# Altium schematic sheet as14120_x31_adc.SchDoc
size A3; PageSetup: Record=PageOptions|CenterHorizontal=True|CenterVertical=True|PrintScale=1.05|XCorrection=1.00|YCorrection=1.00|PrintKind=0|BorderSize=5000000|LeftOffset=0|BottomOffset=0|Orientation=2|PaperLength=4290|PaperWidth=3060|Scale=100|PaperSource=7|PrintQuality=-4|MediaType=1|DitherType=10|PaperKind=A3 (без полей / бумага продольной резки) (297 x 420 мм)|PrintScaleMode=1
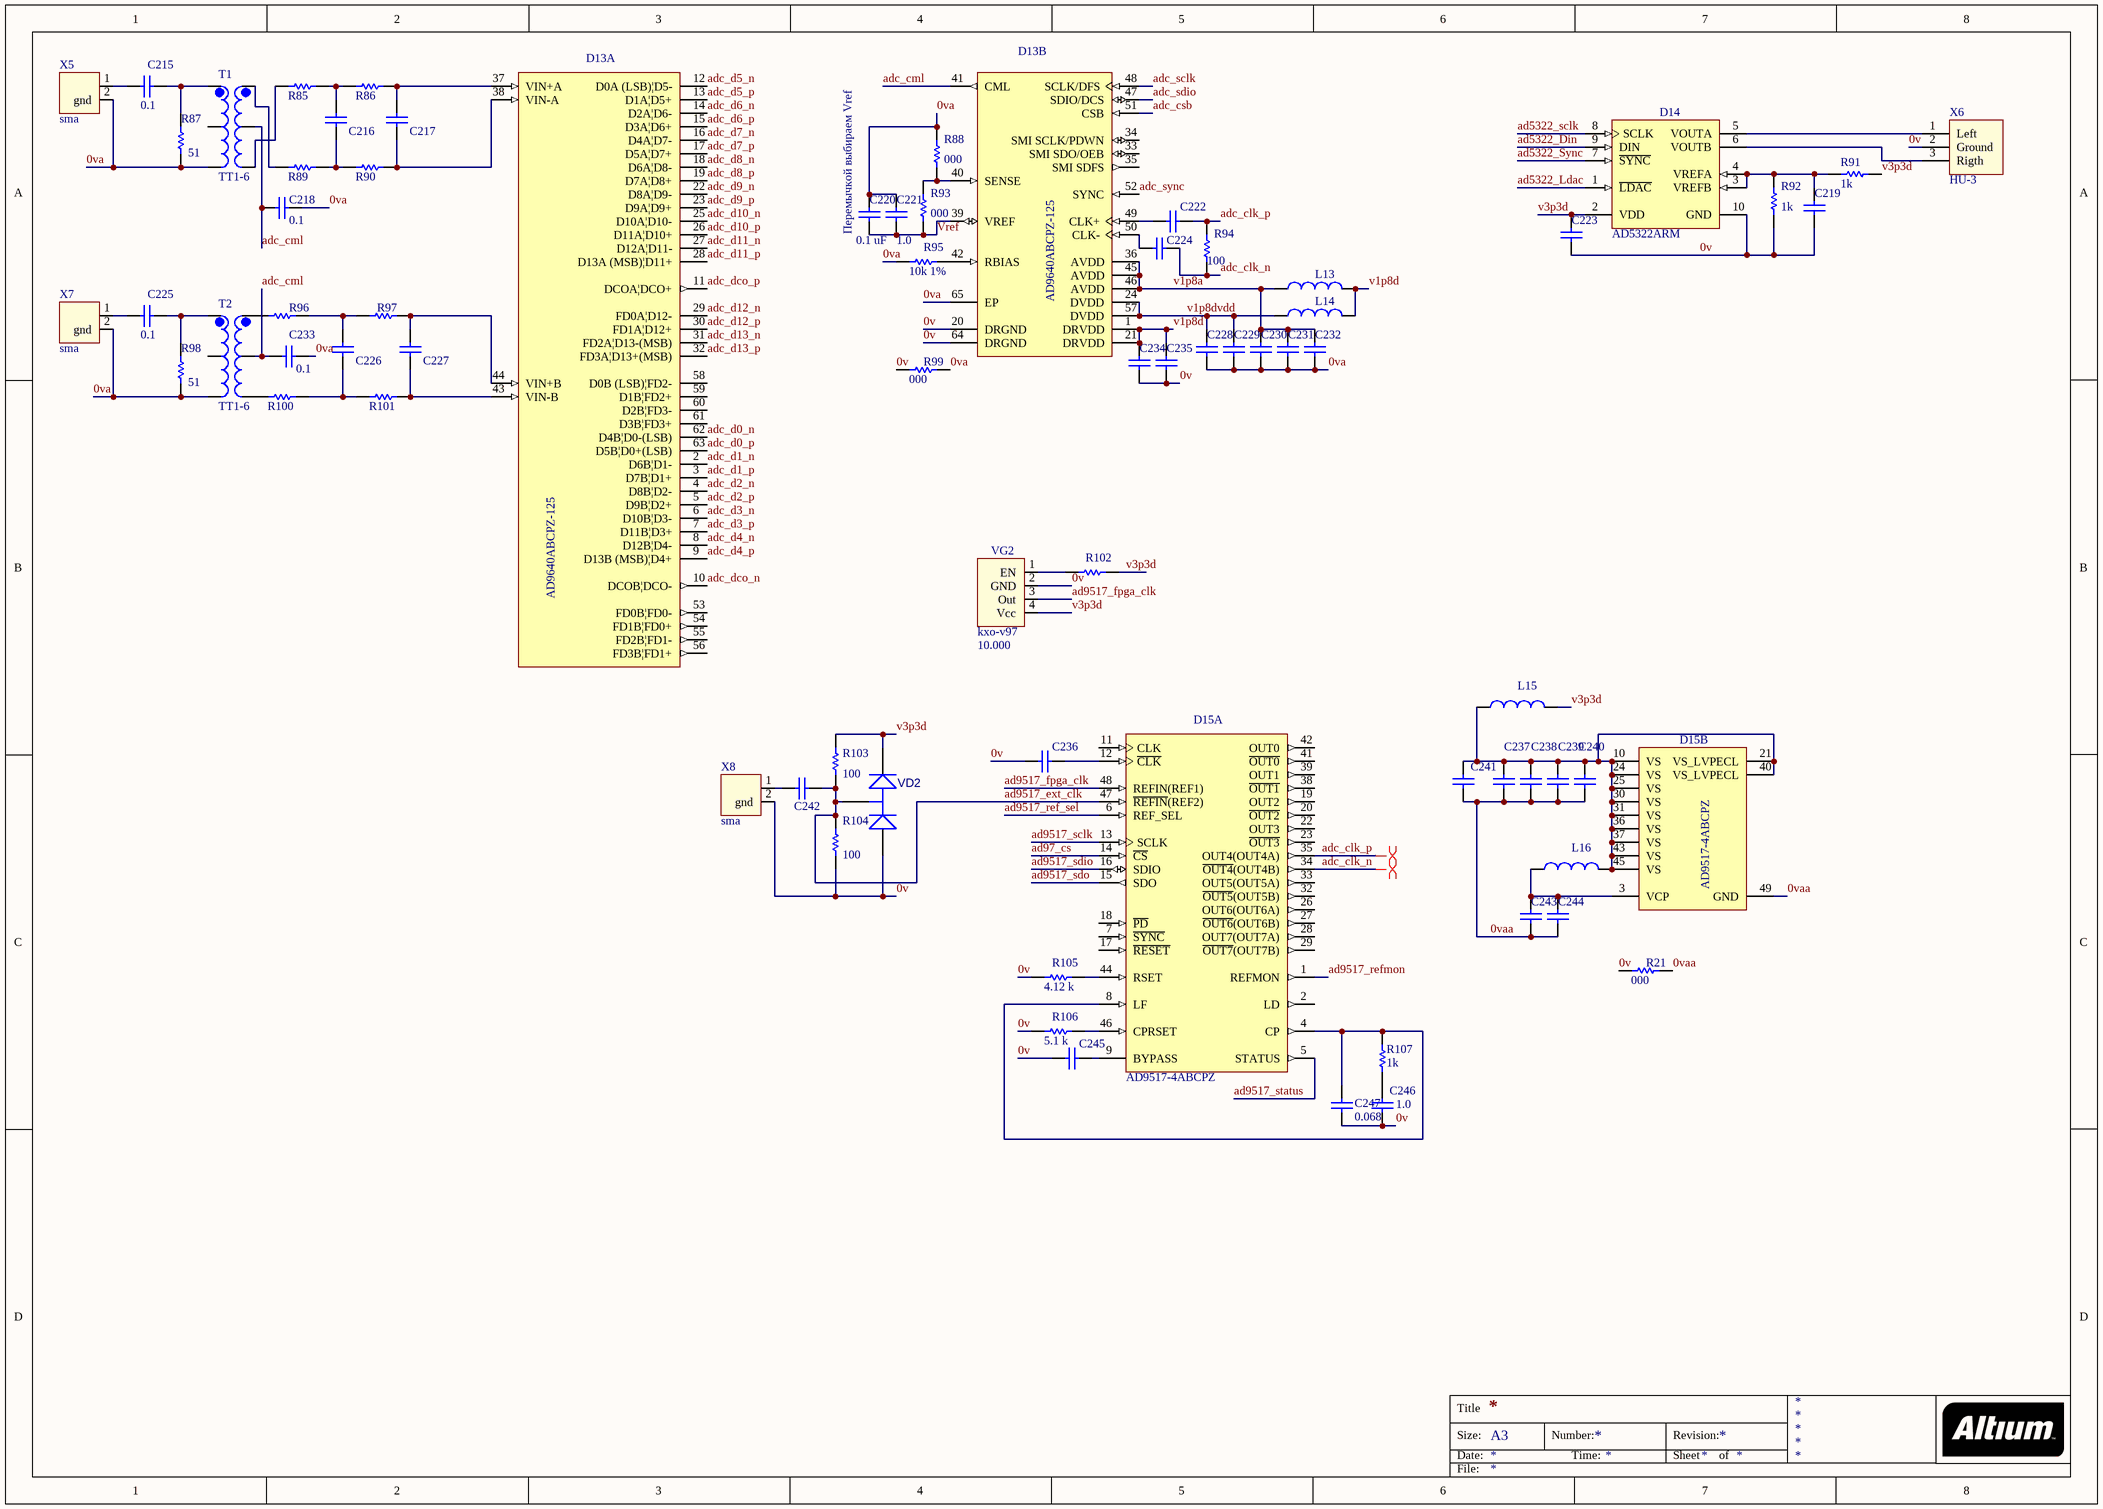
[diagram p0: as14120_x31_adc.SchDoc]

## Parts
C215  value 0.1  [CAPC0402(1005)60_M]  (hidden comment: CAP 1uF 10V 0402(1005))
C216  CAP 1uF 10V 0402(1005)  [CAPC0402(1005)60_M]  (value not drawn)
C217  CAP 1uF 10V 0402(1005)  [CAPC0402(1005)60_M]  (value not drawn)
C218  value 0.1  [CAPC0402(1005)60_M]  (hidden comment: CAP 1uF 10V 0402(1005))
C219  CAP 1uF 10V 0402(1005)  [CAPC0402(1005)60_M]  (value not drawn)
C220  value 0.1 uF  [CAPC0402(1005)60_M]  (hidden comment: CAP 1uF 10V 0402(1005))
C221  value 1.0  [CAPC0402(1005)60_M]  (hidden comment: CAP 1uF 10V 0402(1005))
C222  CAP 1uF 10V 0402(1005)  [CAPC0402(1005)60_M]  (value not drawn)
C223  CAP 1uF 10V 0402(1005)  [CAPC0402(1005)60_M]  (value not drawn)
C224  CAP 1uF 10V 0402(1005)  [CAPC0402(1005)60_M]  (value not drawn)
C225  value 0.1  [CAPC0402(1005)60_M]  (hidden comment: CAP 1uF 10V 0402(1005))
C226  CAP 1uF 10V 0402(1005)  [CAPC0402(1005)60_M]  (value not drawn)
C227  CAP 1uF 10V 0402(1005)  [CAPC0402(1005)60_M]  (value not drawn)
C228  CAP 1uF 10V 0402(1005)  [CAPC0402(1005)60_M]  (value not drawn)
C229  CAP 1uF 10V 0402(1005)  [CAPC0402(1005)60_M]  (value not drawn)
C230  CAP 1uF 10V 0402(1005)  [CAPC0402(1005)60_M]  (value not drawn)
C231  CAP 1uF 10V 0402(1005)  [CAPC0402(1005)60_M]  (value not drawn)
C232  CAP 1uF 10V 0402(1005)  [CAPC0402(1005)60_M]  (value not drawn)
C233  value 0.1  [CAPC0402(1005)60_M]  (hidden comment: CAP 1uF 10V 0402(1005))
C234  CAP 1uF 10V 0402(1005)  [CAPC0402(1005)60_M]  (value not drawn)
C235  CAP 1uF 10V 0402(1005)  [CAPC0402(1005)60_M]  (value not drawn)
C236  CAP 1uF 10V 0402(1005)  [CAPC0402(1005)60_M]  (value not drawn)
C237  CAP 1uF 10V 0402(1005)  [CAPC0402(1005)60_M]  (value not drawn)
C238  CAP 1uF 10V 0402(1005)  [CAPC0402(1005)60_M]  (value not drawn)
C239  CAP 1uF 10V 0402(1005)  [CAPC0402(1005)60_M]  (value not drawn)
C240  CAP 1uF 10V 0402(1005)  [CAPC0402(1005)60_M]  (value not drawn)
C241  CAP 1uF 10V 0402(1005)  [CAPC0402(1005)60_M]  (value not drawn)
C242  CAP 1uF 10V 0402(1005)  [CAPC0402(1005)60_M]  (value not drawn)
C243  CAP 1uF 10V 0402(1005)  [CAPC0402(1005)60_M]  (value not drawn)
C244  CAP 1uF 10V 0402(1005)  [CAPC0402(1005)60_M]  (value not drawn)
C245  CAP 1uF 10V 0402(1005)  [CAPC0402(1005)60_M]  (value not drawn)
C246  value 1.0  [CAPC0805(2012)100_N]  (hidden comment: CAP_0805)
C247  value 0.068  [CAPC0805(2012)100_N]  (hidden comment: CAP_0805)
D13  AD9640ABCPZ-125  [CP-64-6_N]  (parts A,B of 2)
D14  AD5322ARM  [RM-10_L]
D15  AD9517-4ABCPZ  [ADI-CP-48-8_L]  (parts A,B of 2)
L13  BLM21PG300SN1D  [CAPC0805(2012)100_N]  (value not drawn)
L14  BLM21PG300SN1D  [CAPC0805(2012)100_N]  (value not drawn)
L15  BLM21PG300SN1D  [CAPC0805(2012)100_N]  (value not drawn)
L16  BLM21PG300SN1D  [CAPC0805(2012)100_N]  (value not drawn)
R21  000  [RESC0603(1608)_L]
R85  1K 5% 0603(1608)  [RESC0603(1608)_L]  (value not drawn)
R86  1K 5% 0603(1608)  [RESC0603(1608)_L]  (value not drawn)
R87  value 51  [RESC0805(2012)_L]  (hidden comment: 1K 1% 0805(2012))
R88  value 000  [RESC0603(1608)_L]  (hidden comment: 1K 5% 0603(1608))
R89  1K 5% 0603(1608)  [RESC0603(1608)_L]  (value not drawn)
R90  1K 5% 0603(1608)  [RESC0603(1608)_L]  (value not drawn)
R91  1k  [RESC0603(1608)_L]
R92  1k  [RESC0603(1608)_L]
R93  value 000  [RESC0603(1608)_L]  (hidden comment: 1K 5% 0603(1608))
R94  100  [RESC0805(2012)_L]
R95  10k 1%  [RESC0805(2012)_L]
R96  1K 5% 0603(1608)  [RESC0603(1608)_L]  (value not drawn)
R97  1K 5% 0603(1608)  [RESC0603(1608)_L]  (value not drawn)
R98  value 51  [RESC0805(2012)_L]  (hidden comment: 1K 1% 0805(2012))
R99  000  [RESC0603(1608)_L]
R100  1K 5% 0603(1608)  [RESC0603(1608)_L]  (value not drawn)
R101  1K 5% 0603(1608)  [RESC0603(1608)_L]  (value not drawn)
R102  1K 5% 0603(1608)  [RESC0603(1608)_L]  (value not drawn)
R103  value 100  [RESC0805(2012)_L]  (hidden comment: 1K 1% 0805(2012))
R104  value 100  [RESC0805(2012)_L]  (hidden comment: 1K 1% 0805(2012))
R105  value 4.12 k  [RESC0805(2012)_L]  (hidden comment: 1K 1% 0805(2012))
R106  value 5.1 k  [RESC0805(2012)_L]  (hidden comment: 1K 1% 0805(2012))
R107  value 1k  [RESC0805(2012)_L]  (hidden comment: 1K 1% 0805(2012))
T1  TT1-6  [TT!-6-KK81]
T2  TT1-6  [TT!-6-KK81]
VD2  BAV99  [SO-G3/X.9]  (value not drawn)
VG2  kxo-v97  value 10.000  [kxo-v97]
X5  sma  [sma]
X6  HU-3  [HU-3]
X7  sma  [sma]
X8  sma  [sma]

## Nets
0v: C219.1 C223.1 C234.1 C235.1 C236.1 C245.1 C246.1 C247.1 D13.20(DRGND) D13.64(DRGND) D14.10(GND) R21.1 R92.2 R99.1 R104.1 R105.2 R106.2 VD2.3(A) VG2.2(GND) X6.2(Ground) X8.2(gnd)
0va: C218.2 C220.2 C221.2 C228.1 C229.1 C230.1 C231.1 C232.1 C233.2 D13.65(EP) R87.1 R88.1 R95.2 R98.1 R99.2 T1.6 T2.6 X5.2(gnd) X7.2(gnd)
0vaa: C237.1 C238.1 C239.1 C240.1 C241.1 C243.1 C244.1 D15.49(GND) R21.2
ad97_cs: D15.14(~{CS})
ad5322_Din: D14.9(DIN)
ad5322_Ldac: D14.1(~{LDAC})
ad5322_sclk: D14.8(SCLK)
ad5322_Sync: D14.7(~{SYNC})
ad9517_ext_clk: C242.2 D15.47(~{REFIN}(REF2)) R103.1 R104.2 VD2.1(C)
ad9517_fpga_clk: D15.48(REFIN(REF1)) VG2.3(Out)
ad9517_ref_sel: D15.6(REF_SEL)
ad9517_refmon: D15.1(REFMON)
ad9517_sclk: D15.13(SCLK)
ad9517_sdio: D15.16(SDIO)
ad9517_sdo: D15.15(SDO)
ad9517_status: D15.5(STATUS)
adc_clk_n: C224.1 D15.34(~{OUT4}(OUT4B)) R94.1
adc_clk_p: C222.1 D15.35(OUT4(OUT4A)) R94.2
adc_cml: C218.1 C233.1 D13.41(CML) T1.2 T2.2
adc_csb: D13.51(CSB)
adc_d0_n: D13.62(D4B|D0-(LSB))
adc_d0_p: D13.63(D5B|D0+(LSB))
adc_d1_n: D13.2(D6B|D1-)
adc_d1_p: D13.3(D7B|D1+)
adc_d2_n: D13.4(D8B|D2-)
adc_d2_p: D13.5(D9B|D2+)
adc_d3_n: D13.6(D10B|D3-)
adc_d3_p: D13.7(D11B|D3+)
adc_d4_n: D13.8(D12B|D4-)
adc_d4_p: D13.9(D13B_(MSB)|D4+)
adc_d5_n: D13.12(D0A_(LSB)|D5-)
adc_d5_p: D13.13(D1A|D5+)
adc_d6_n: D13.14(D2A|D6-)
adc_d6_p: D13.15(D3A|D6+)
adc_d7_n: D13.16(D4A|D7-)
adc_d7_p: D13.17(D5A|D7+)
adc_d8_n: D13.18(D6A|D8-)
adc_d8_p: D13.19(D7A|D8+)
adc_d9_n: D13.22(D8A|D9-)
adc_d9_p: D13.23(D9A|D9+)
adc_d10_n: D13.25(D10A|D10-)
adc_d10_p: D13.26(D11A|D10+)
adc_d11_n: D13.27(D12A|D11-)
adc_d11_p: D13.28(D13A_(MSB)|D11+)
adc_d12_n: D13.29(FD0A|D12-)
adc_d12_p: D13.30(FD1A|D12+)
adc_d13_n: D13.31(FD2A|D13-(MSB))
adc_d13_p: D13.32(FD3A|D13+(MSB))
adc_dco_n: D13.10(DCOB|DCO-)
adc_dco_p: D13.11(DCOA|DCO+)
adc_sclk: D13.48(SCLK/DFS)
adc_sdio: D13.47(SDIO/DCS)
adc_sync: D13.52(SYNC)
v1p8a: C230.2 C231.2 C232.2 D13.36(AVDD) D13.45(AVDD) D13.46(AVDD) L13.1
v1p8d: C234.2 C235.2 D13.1(DRVDD) D13.21(DRVDD) L13.2 L14.2
v1p8dvdd: C228.2 C229.2 D13.24(DVDD) D13.57(DVDD) L14.1
v3p3d: C223.2 D14.2(VDD) L15.2 R91.2 R102.1 R103.2 VD2.2(K) VG2.4(Vcc)
Vref: C220.1 C221.1 D13.39(VREF) R93.2
NetC215_1: C215.1 X5.1
NetC215_2: C215.2 R87.2 T1.4
NetC216_1: C216.1 R89.1 R90.2
NetC216_2: C216.2 R85.1 R86.2
NetC217_1: C217.1 D13.38(VIN-A) R90.1
NetC217_2: C217.2 D13.37(VIN+A) R86.1
NetC219_2: C219.2 D14.3(VREFB) D14.4(VREFA) R91.1 R92.1
NetC222_2: C222.2 D13.49(CLK+)
NetC224_2: C224.2 D13.50(CLK-)
NetC225_1: C225.1 X7.1
NetC225_2: C225.2 R98.2 T2.4
NetC226_1: C226.1 R100.1 R101.2
NetC226_2: C226.2 R96.1 R97.2
NetC227_1: C227.1 D13.43(VIN-B) R101.1
NetC227_2: C227.2 D13.44(VIN+B) R97.1
NetC236_2: C236.2 D15.12(~{CLK})
NetC237_2: C237.2 C238.2 C239.2 C240.2 C241.2 D15.10(VS) D15.21(VS_LVPECL) D15.24(VS) D15.25(VS) D15.30(VS) D15.31(VS) D15.36(VS) D15.37(VS) D15.40(VS_LVPECL) D15.43(VS) D15.45(VS) L15.1 L16.2
NetC242_1: C242.1 X8.1
NetC243_2: C243.2 C244.2 D15.3(VCP) L16.1
NetC245_2: C245.2 D15.9(BYPASS)
NetC246_2: C246.2 R107.2
NetC247_2: C247.2 D15.4(CP) D15.8(LF) R107.1
NetD13_40: D13.40(SENSE) R88.2 R93.1
NetD13_42: D13.42(RBIAS) R95.1
NetD14_5: D14.5(VOUTA) X6.1(Left)
NetD14_6: D14.6(VOUTB) X6.3(Rigth)
NetD15_44: D15.44(RSET) R105.1
NetD15_46: D15.46(CPRSET) R106.1
NetR85_2: R85.2 T1.1
NetR89_2: R89.2 T1.3
NetR96_2: R96.2 T2.3
NetR100_2: R100.2 T2.1
NetR102_2: R102.2 VG2.1(EN)

Not connected (* = marked no-connect by the designer): D13 33(SMI_SDO/OEB) 34(SMI_SCLK/PDWN) 35(SMI_SDFS) 53(FD0B|FD0-) 54(FD1B|FD0+) 55(FD2B|FD1-) 56(FD3B|FD1+) 58(D0B_(LSB)|FD2-) 59(D1B|FD2+) 60(D2B|FD3-) 61(D3B|FD3+); D15 2(LD) 7(~{SYNC}) 11(CLK) 17(~{RESET}) 18(~{PD}) 19(OUT2) 20(~{OUT2}) 22(OUT3) 23(~{OUT3}) 26(OUT6(OUT6A)) 27(~{OUT6}(OUT6B)) 28(OUT7(OUT7A)) 29(~{OUT7}(OUT7B)) 32(~{OUT5}(OUT5B)) 33(OUT5(OUT5A)) 38(~{OUT1}) 39(OUT1) 41(~{OUT0}) 42(OUT0); T1 5; T2 5

## Layout directives
differential pair: adc_clk_n, adc_clk_p

## Notes on the sheet
- (near C220) Перемычкой выбираем Vref
- Title
- Size:
- Date:
- A3
- Number:
- Time:
- Revision:
- Sheet
- of
- File:

## Library data of the parts
C215-C218 C220 C221 C225-C227 C233 = CAP_0402: CAP 1uF 10V ±20% 0402 (1005 Metric) Thickness 0.6mm SMD; Case-Metric: 1005; Case-EIA: 0402; Tolerance: ±20%; Max Thickness: 0.6 mm; Rated Voltage: 10 V; Technology: SMT
  C216 C217 C226 C227: Value: 1uF
C219 C222-C224 C228-C232 C234-C241 C243-C245 = CAP_0402: CAP 1uF 10V ±20% 0402 (1005 Metric) Thickness 0.6mm SMD; Case-Metric: 1005; Case-EIA: 0402; Value: 0.1 uF; Tolerance: ±20%; Max Thickness: 0.6 mm; Rated Voltage: 10 V; Technology: SMT
C242 = CAP_0402: CAP 1uF 10V ±20% 0402 (1005 Metric) Thickness 0.6mm SMD; Case-Metric: 1005; Case-EIA: 0402; Value: 0.01 uF; Tolerance: ±20%; Max Thickness: 0.6 mm; Rated Voltage: 10 V; Technology: SMT
D13 = AD9640ABCPZ-125: Dual 14-Bit Analog-to-Digital Converter with Parallel Interface, 1.8 V, 125MSPS, -40 to +85 degC, CP-64-6, Pb-Free, Tray; Part Number: AD9640-125; Manufacturer: Analog Devices; Resolution (Bits): 14; Channels: 2; Throughput Rate (SPS): 125M; Interface: Par; DatasheetVersion: Rev.B; PackageVersion: 041509-A; PackageReference: CP-64-6; PackageDescription: 64-Lead Lead Frame Chip Scale Package [LFCSP_VQ] 9 x 9 mm Body, Very Thin Quad; RoHS: Y; Packing: Tray; Mounting Technology: Surface Mount; Code_JEDEC: MO-220-VMMD-4; ComponentLink1Description: Manufacturer URL; ComponentLink1URL: http://www.analog.com/en/index.html; ComponentLink2Description: Datasheet; ComponentLink2URL: http://www.analog.com/static/imported-files/data_sheets/AD9640.pdf; ComponentLink3Description: Package Specification; ComponentLink3URL: http://www.analog.com/static/imported-files/packages/PKG_PDF/LFCSP(CP)/CP_64_6.pdf; ComponentLink4Description: Product URL; ComponentLink4URL: http://www.analog.com/en/analog-to-digital-converters/ad-converters/ad9640/products/product.html
D14 = AD5322ARM: Dual 12-Bit Rail-to-Rail Output Digital-to-Analog Converter, 2.5 to 5.5 V, -40 to +105 degC, RM-10, Tube; ADI Part Number: AD5322; Manufacturer: Analog Devices; # DAC Outputs: 2; Max V+: 5.5V; Op Pwr Diss: 2.5mW; Resolution (Bits): 12; Settling Time: 8µs; Single Supply: Yes; DatasheetVersion: Rev.D; PackageVersion: May-2005; PackageReference: RM-10; PackageDescription: 10-Lead Mini Small Outline Package [MSOP]; Packing: Tube; RoHS: N; Mounting Technology: Surface Mount; ComponentLink1Description: Manufacturer URL; ComponentLink1URL: http://www.analog.com/en/index.html; ComponentLink2Description: Datasheet; ComponentLink2URL: http://www.analog.com/static/imported-files/data_sheets/AD5302_5312_5322.pdf; ComponentLink3Description: Package Specification; ComponentLink3URL: http://www.analog.com/static/imported-files/packages/PKG_PDF/MSOP%28RM%29/RM_10.pdf; ComponentLink4Description: URL Link1; ComponentLink4URL: Product URL:http://www.analog.com/en/digital-to-analog-converters/da-converters/ad5322/products/product.html
D15 = AD9517-4ABCPZ: 12-Output Clock Generator with Integrated 2.5 GHz VCO, 1800 MHz Max f-out, CP-48-8, Pb-Free, 260 Tray; Product Description: Multi-Output Clock Generator; +Supply Voltage (V): 3.3; Inputs: 2; Outputs: 12; Dividers: 4; On-Chip VCO or DCO: Yes; Max f-out (MHz): 1800; Output Logic: CMOS; LVDS; LVPECL; DatasheetVersion: Rev.D; PackageVersion: 02-23-2010-C; PackageReference: CP-48-8; PackageDescription: 48-Lead Lead Frame Chip Scale Package [LFCSP_VQ]; Code_JEDEC: MO-220-VKKD-2; ComponentLink1Description: Manufacturer URL; ComponentLink1URL: www.analog.com; ComponentLink2Description: Datasheet; ComponentLink2URL: http://www.analog.com/static/imported-files/data_sheets/AD9517-4.pdf; ComponentLink3Description: Package Specification; ComponentLink3URL: http://www.analog.com/static/imported-files/packages/PKG_PDF/LFCSP(CP)/CP_48_8.pdf
L13-L16 = Ferrite_beat
R21 R88 R91-R93 R99 = RES_0603: 1K 0.1W 5% 0603 (1608 Metric)  SMD; Case-Metric: 1608; Case-EIA: 0603; Tolerance: 5 %; Power: 0.1 W; Technology: SMT
  R21 R99: Value: 000
  R91 R92: Value: 1k
R85 R86 R89 R90 R96 R97 R100 R101 = RES_0603: 1K 0.1W 5% 0603 (1608 Metric)  SMD; Case-Metric: 1608; Value: 1000.00 Ohm; Case-EIA: 0603; Tolerance: 5 %; Power: 0.1 W; Technology: SMT
R87 R94 R95 R98 R103-R107 = RES_0805: 1K 0.125W 1% 0805 (2012 Metric)  SMD; Case-Metric: 2012; Case-EIA: 0805; Tolerance: 1 %; Power: 0.125 W; Technology: SMT
  R94: Value: 100
  R95: Value: 10k 1%
R102 = RES_0603: 1K 0.1W 5% 0603 (1608 Metric)  SMD; Case-EIA: 0603; Case-Metric: 1608; Value: 1000.00 Ohm; Technology: SMT; Tolerance: 5 %; Power: 0.1 W
T1 T2 = TT1-6-KK81
VD2 = BAV99: SOT23 Silicon Planar High-Speed Switching Series Diode Pair; Value: {Value}; OriginalName: BAV99